# EAGLE schematic New Grads 2019 Keychain (EAGLE 9.2.2)
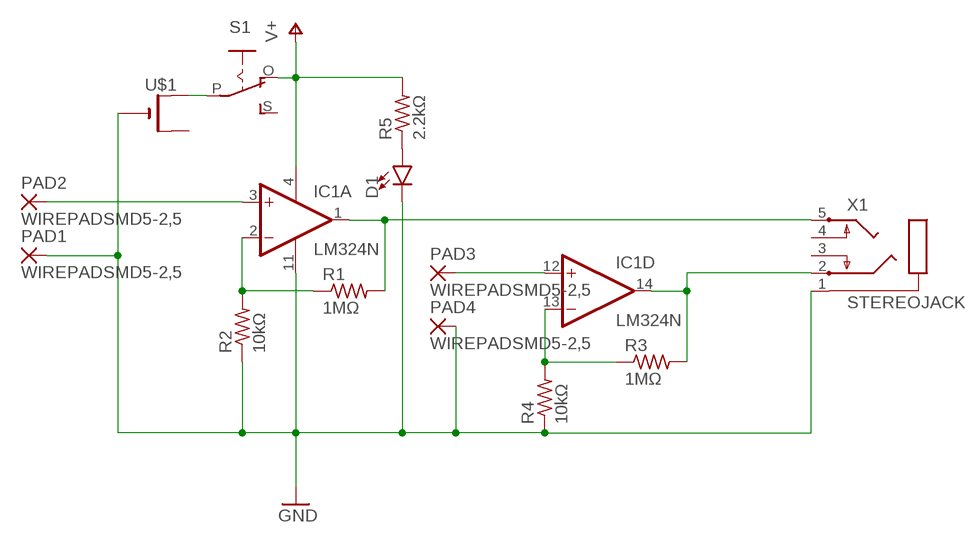
[diagram p0: schematic, sheet 1]

## Parts
D1  LED-3MM-NO_SILK  [LED_3MM-NS]
IC1  LM324N  [DIL14]
PAD1  WIREPADSMD5-2,5  [5-2,5]
PAD2  WIREPADSMD5-2,5  [5-2,5]
PAD3  WIREPADSMD5-2,5  [5-2,5]
PAD4  WIREPADSMD5-2,5  [5-2,5]
R1  1MΩ  R-US_0204/5  [0204/5]
R2  10kΩ  R-US_0204/5  [0204/5]
R3  1MΩ  R-US_0204/5  [0204/5]
R4  10kΩ  R-US_0204/5  [0204/5]
R5  2.2kΩ  R-US_0204/5  [0204/5]
S1  EG1218S  [EG1218]
U$1  CR1220THM  [CR1220-THM]
X1  STEREOJACK  [STX3100]

## Nets
GND: D1.K(C) IC1.11(P:V-) PAD1.1(P) PAD4.1(P) R2.1 R4.1 U$1.- X1.1
N$1: IC1.1(A:OUT) R1.2 X1.5
N$2: IC1.2(A:-IN) R1.1 R2.2
N$3: S1.P U$1.+1(+)
N$4: IC1.3(A:+IN) PAD2.1(P)
N$5: IC1.13(D:-IN) R3.1 R4.2
N$6: IC1.14(D:OUT) R3.2 X1.2
N$7: IC1.12(D:+IN) PAD3.1(P)
N$8: D1.A R5.1
V+: IC1.4(P:V+) R5.2 S1.O
Unconnected: IC1.5(B:+IN) IC1.6(B:-IN) IC1.7(B:OUT) IC1.8(C:OUT) IC1.9(C:-IN) IC1.10(C:+IN) S1.S U$1.+2(+1) X1.3 X1.4

## Library data of the parts
D1 = SparkFun-LED:LED: LED (Generic) Standard schematic elements and footprints for 5mm, 3mm, 1206, and 0603 sized LEDs. Generic LEDs with no color specified.
IC1 = linear:LM324: OP AMP
PAD1-PAD4 = wirepad:WIREPAD: Wire PAD connect wire on PCB
R1-R5 = rcl:R-US_: RESISTOR, American symbol; SPICEPREFIX: R
S1 = adafruit:EG1218: SLIDING SWITCH 0.1" spacing through hole, vertical SPDT slide switch http://www.ladyada.net/library/pcb/eaglelibrary.html
U$1 = adafruit:CR1220: CR1216/CR1220/CR1225 12mm 3V lithium coin cell Great for battery packup. Both SMT and THM holders. Note the THM package has the ground pads on both sides of the PCB so that the masks are the same - this reduces the cost
X1 = adafruit:STEREOJACK: MIC/HEADPHONE JACK Stereo jack with two switches. Kycon STX3100, CUI SJ1-3555NG and/or 4UCon 05544